# Altium project stm8l_resp.PrjPCB
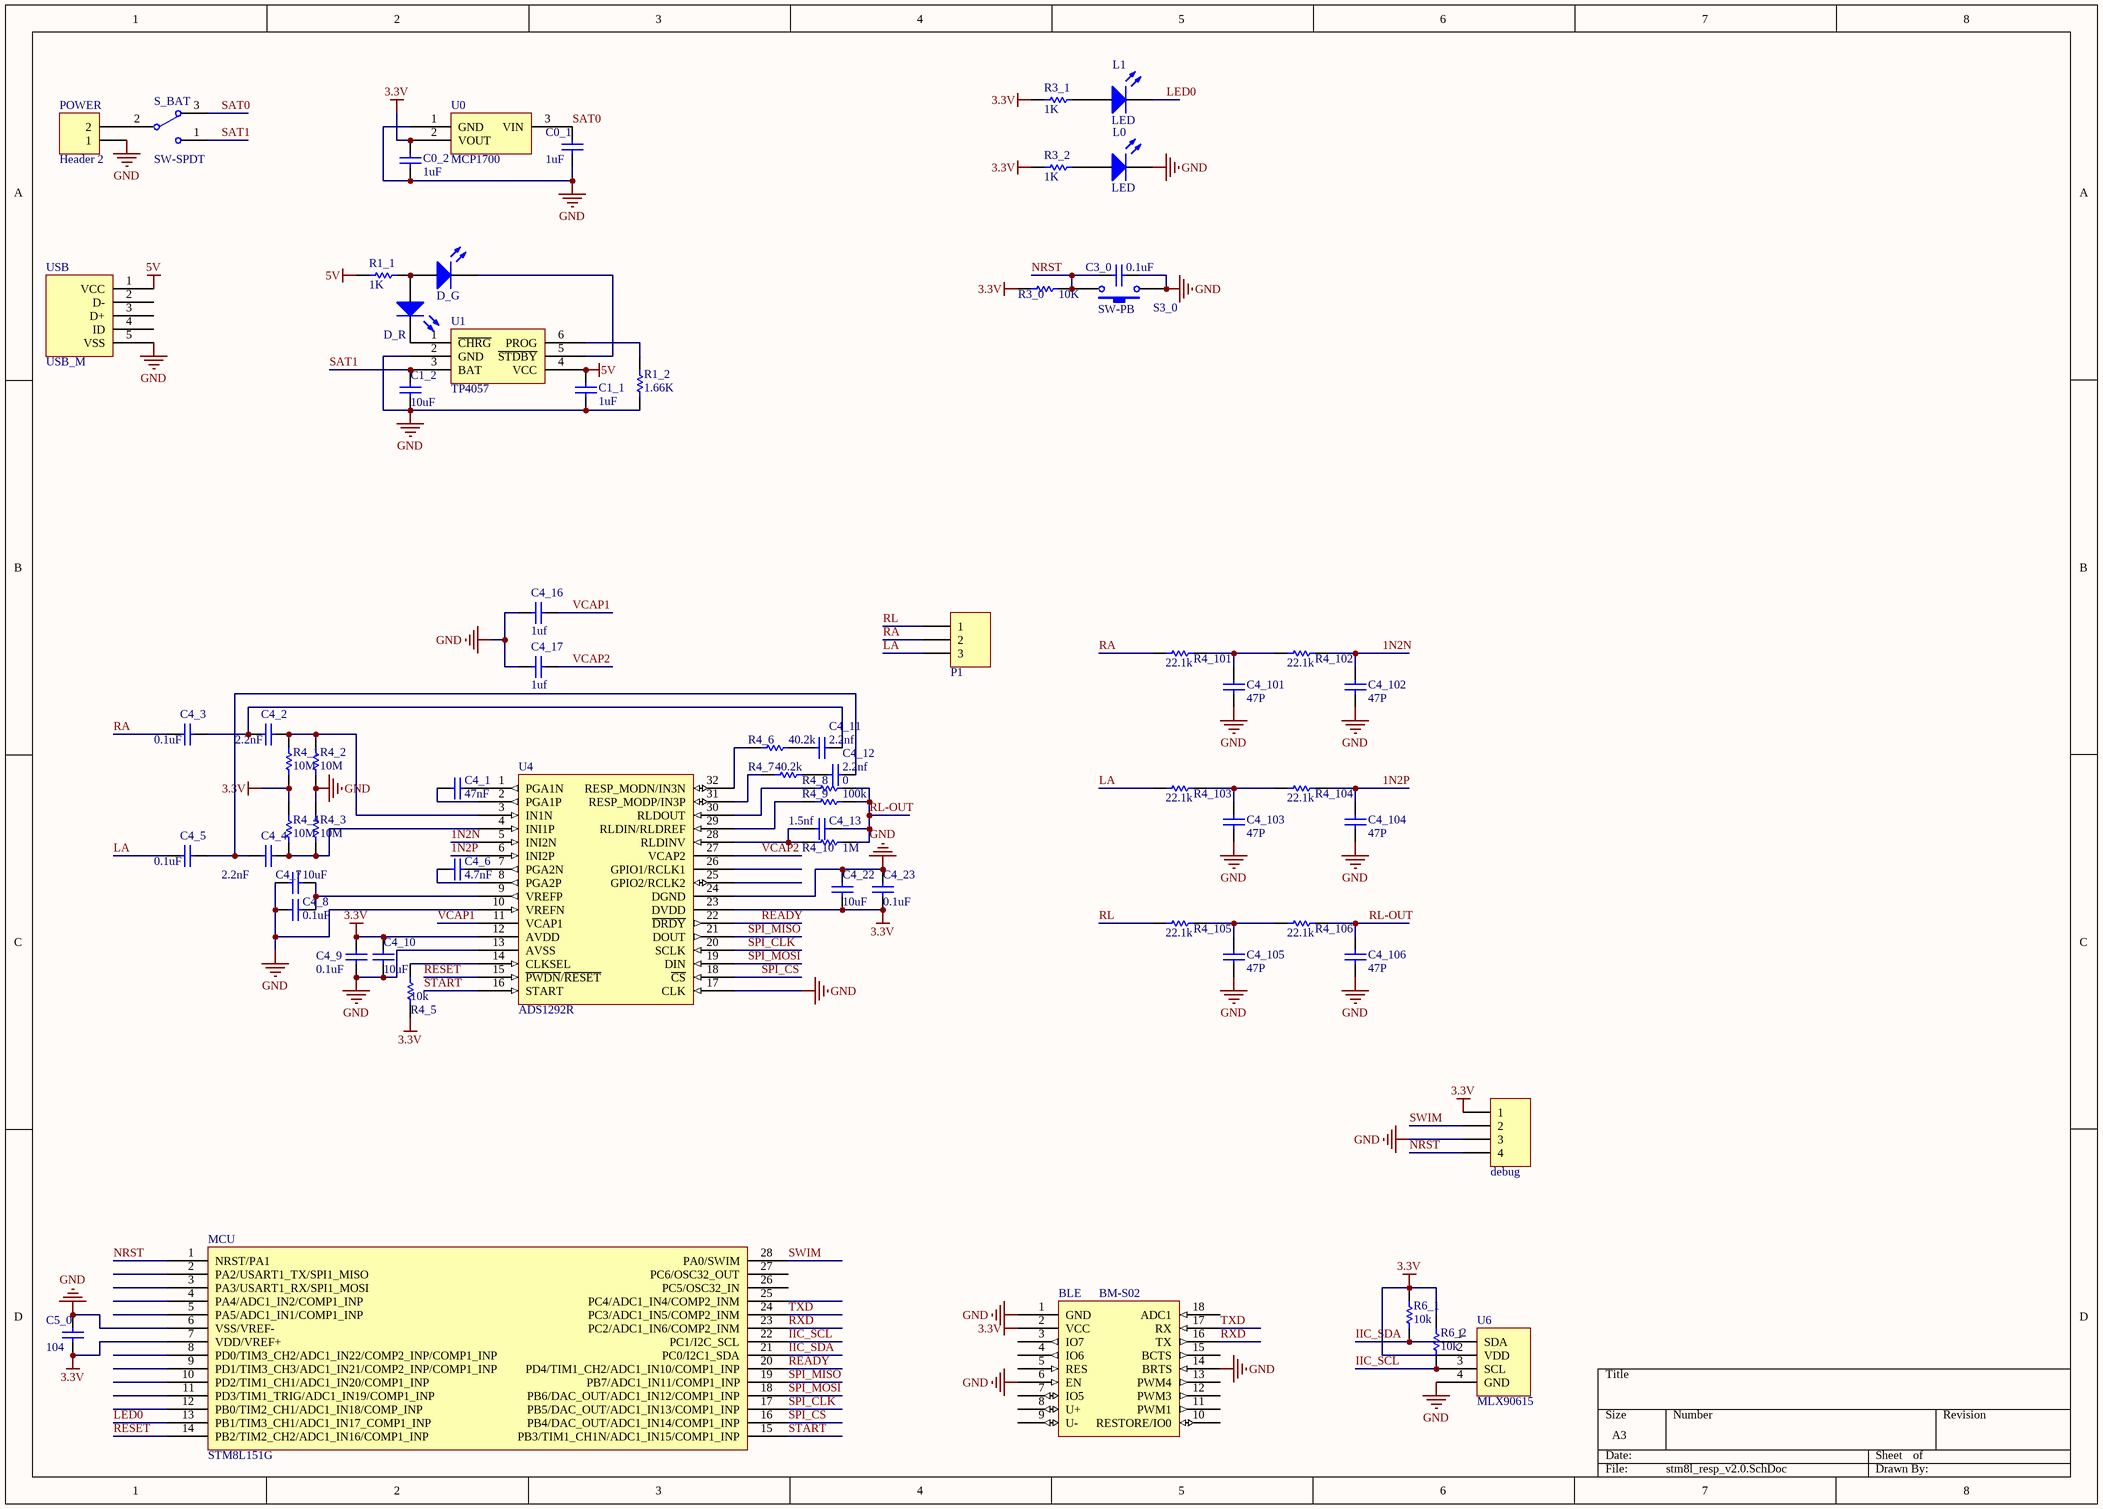
[diagram p0: stm8l_resp_v2.0.SchDoc]
1 sheet, 68 parts. Net scope: global (net labels, ports and power ports of the same name join across sheets).
Board file: stm8l_resp_v2.0.PcbDoc

## Sheet stm8l_resp_v2.0.SchDoc
size A3

### Parts
BLE  BM-S02  [BM-S02]
C0_1  value 1uF  [C-RAD-0603]  (hidden comment: Cap)
C0_2  value 1uF  [C-RAD-0603]  (hidden comment: Cap)
C1_1  value 1uF  [C-RAD-0603]  (hidden comment: Cap)
C1_2  value 10uF  [C-RAD-0603]  (hidden comment: Cap)
C3_0  value 0.1uF  [C-RAD-0603]  (hidden comment: Cap)
C4_1  value 47nF  [C-RAD-0603]  (hidden comment: Cap)
C4_2  value 2.2nF  [C-RAD-0603]  (hidden comment: Cap)
C4_3  value 0.1uF  [C-RAD-0603]  (hidden comment: Cap)
C4_4  value 2.2nF  [C-RAD-0603]  (hidden comment: Cap)
C4_5  value 0.1uF  [C-RAD-0603]  (hidden comment: Cap)
C4_6  value 4.7nF  [C-RAD-0603]  (hidden comment: Cap)
C4_7  value 10uF  [C-RAD-0603]  (hidden comment: Cap)
C4_8  value 0.1uF  [C-RAD-0603]  (hidden comment: Cap)
C4_9  value 0.1uF  [C-RAD-0603]  (hidden comment: Cap)
C4_10  value 10uF  [C-RAD-0603]  (hidden comment: Cap)
C4_11  value 2.2nf  [C-RAD-0603]  (hidden comment: Cap)
C4_12  value 2.2nf  [C-RAD-0603]  (hidden comment: Cap)
C4_13  value 1.5nf  [C-RAD-0603]  (hidden comment: Cap)
C4_16  value 1uf  [C-RAD-0603]  (hidden comment: Cap)
C4_17  value 1uf  [C-RAD-0603]  (hidden comment: Cap)
C4_22  value 10uF  [C-RAD-0603]  (hidden comment: Cap)
C4_23  value 0.1uF  [C-RAD-0603]  (hidden comment: Cap)
C4_101  value 47P  [C-RAD-0603]  (hidden comment: Cap)
C4_102  value 47P  [C-RAD-0603]  (hidden comment: Cap)
C4_103  value 47P  [C-RAD-0603]  (hidden comment: Cap)
C4_104  value 47P  [C-RAD-0603]  (hidden comment: Cap)
C4_105  value 47P  [C-RAD-0603]  (hidden comment: Cap)
C4_106  value 47P  [C-RAD-0603]  (hidden comment: Cap)
C5_0  value 104  [C-RAD-0603]  (hidden comment: Cap)
D_G  LED0  [0603-LED]  (value not drawn)
D_R  LED0  [0603-LED]  (value not drawn)
debug  Header 4  [HDR4X1_A]  (value not drawn)
L0  LED  [0603-LED]
L1  LED  [0603-LED]
MCU  STM8L151G  [STM8L-QFN28]
P1  Header 3  [HDR3X1_A]  (value not drawn)
POWER  Header 2  [HDR1X2]
R1_1  value 1K  [0603-1]  (hidden comment: Res1)
R1_2  value 1.66K  [0603-1]  (hidden comment: Res1)
R3_0  value 10K  [0603-1]  (hidden comment: Res1)
R3_1  value 1K  [0603-1]  (hidden comment: Res1)
R3_2  value 1K  [0603-1]  (hidden comment: Res1)
R4_1  value 10M  [0603-1]  (hidden comment: Res1)
R4_2  value 10M  [0603-1]  (hidden comment: Res1)
R4_3  value 10M  [0603-1]  (hidden comment: Res1)
R4_4  value 10M  [0603-1]  (hidden comment: Res1)
R4_5  value 10k  [0603-1]  (hidden comment: Res1)
R4_6  value 40.2k  [0603-1]  (hidden comment: Res1)
R4_7  value 40.2k  [0603-1]  (hidden comment: Res1)
R4_8  value 0  [0603-1]  (hidden comment: Res1)
R4_9  value 100k  [0603-1]  (hidden comment: Res1)
R4_10  value 1M  [0603-1]  (hidden comment: Res1)
R4_101  value 22.1k  [0603-1]  (hidden comment: Res1)
R4_102  value 22.1k  [0603-1]  (hidden comment: Res1)
R4_103  value 22.1k  [0603-1]  (hidden comment: Res1)
R4_104  value 22.1k  [0603-1]  (hidden comment: Res1)
R4_105  value 22.1k  [0603-1]  (hidden comment: Res1)
R4_106  value 22.1k  [0603-1]  (hidden comment: Res1)
R6_1  value 10k  [0603-1]  (hidden comment: Res1)
R6_2  value 10k  [0603-1]  (hidden comment: Res1)
S3_0  SW-PB  [SW_PB2_2*4]
S_BAT  SW-SPDT  [SWITCH_1P2T]
U0  MCP1700  [SOT-23]
U1  TP4057  [TP4057]
U4  ADS1292R  [ADS1292R-QFN-32]
U6  MLX90615  [MLX90615-2]
USB  USB_M  [USB_MICRO]

### Nets
3.3V: BLE.2(VCC) C0_2.2 C4_9.1 C4_10.1 C4_22.2 C4_23.2 C5_0.1 debug.1 MCU.7(VDD/VREF+) R3_0.1 R3_1.1 R3_2.1 R4_1.1 R4_4.2 R4_5.1 R6_1.2 R6_2.2 U0.2(VOUT) U4.12(AVDD) U4.23(DVDD) U6.2(VDD)
5V: C1_1.2 R1_1.2 U1.4(VCC) USB.1(VCC)
GND: BLE.1(GND) BLE.6(EN) BLE.14(BRTS) C0_1.1 C0_2.1 C1_1.1 C1_2.2 C3_0.1 C4_7.1 C4_8.2 C4_9.2 C4_10.2 C4_16.2 C4_17.2 C4_22.1 C4_23.1 C4_101.2 C4_102.2 C4_103.2 C4_104.2 C4_105.2 C4_106.2 C5_0.2 debug.3 L0.2(K) MCU.6(VSS/VREF-) POWER.1 R1_2.2 R4_2.1 R4_3.2 S3_0.1 U0.1(GND) U1.2(GND) U4.10(VREFN) U4.13(AVSS) U4.17(CLK) U4.24(DGND) U6.4(GND) USB.5(VSS)
1N2N: C4_102.1 R4_102.2 U4.5(INI2N)
1N2P: C4_104.1 R4_104.2 U4.6(INI2P)
IIC_SCL: MCU.22(PC1/I2C_SCL) R6_2.1 U6.3(SCL)
IIC_SDA: MCU.21(PC0/I2C1_SDA) R6_1.1 U6.1(SDA)
LA: C4_5.1 P1.3 R4_103.1
LED0: L1.2(K) MCU.13(PB1/TIM3_CH1/ADC1_IN17_COMP1_INP)
NRST: C3_0.2 debug.4 MCU.1(NRST/PA1) R3_0.2 S3_0.2
RA: C4_3.1 P1.2 R4_101.1
READY: MCU.20(PD4/TIM1_CH2/ADC1_IN10/COMP1_INP) U4.22(~{DRDY})
RESET: MCU.14(PB2/TIM2_CH2/ADC1_IN16/COMP1_INP) U4.15(~{PWDN}/~{RESET})
RL: P1.1 R4_105.1
RL-OUT: C4_13.1 C4_106.1 R4_8.1 R4_9.2 R4_10.2 R4_106.2
RXD: BLE.16(TX) MCU.23(PC2/ADC1_IN6/COMP2_INM)
SAT0: C0_1.2 S_BAT.3 U0.3(VIN)
SAT1: C1_2.1 S_BAT.1 U1.3(BAT)
SPI_CLK: MCU.17(PB5/DAC_OUT/ADC1_IN13/COMP1_INP) U4.20(SCLK)
SPI_CS: MCU.16(PB4/DAC_OUT/ADC1_IN14/COMP1_INP) U4.18(~{CS})
SPI_MISO: MCU.19(PB7/ADC1_IN11/COMP1_INP) U4.21(DOUT)
SPI_MOSI: MCU.18(PB6/DAC_OUT/ADC1_IN12/COMP1_INP) U4.19(DIN)
START: MCU.15(PB3/TIM1_CH1N/ADC1_IN15/COMP1_INP) U4.16(START)
SWIM: debug.2 MCU.28(PA0/SWIM)
TXD: BLE.17(RX) MCU.24(PC3/ADC1_IN5/COMP2_INM)
VCAP1: C4_16.1 U4.11(VCAP1)
VCAP2: C4_17.1 U4.27(VCAP2)
NetC4_1_1: C4_1.1 U4.2(PGA1P)
NetC4_1_2: C4_1.2 U4.1(PGA1N)
NetC4_2_1: C4_2.1 C4_3.2 C4_11.1
NetC4_2_2: C4_2.2 R4_1.2 R4_2.2 U4.3(IN1N)
NetC4_4_1: C4_4.1 C4_5.2 C4_12.1
NetC4_4_2: C4_4.2 R4_3.1 R4_4.1 U4.4(INI1P)
NetC4_6_1: C4_6.1 U4.7(PGA2N)
NetC4_6_2: C4_6.2 U4.8(PGA2P)
NetC4_7_2: C4_7.2 C4_8.1 U4.9(VREFP)
NetC4_11_2: C4_11.2 R4_6.2
NetC4_12_2: C4_12.2 R4_7.1
NetC4_13_2: C4_13.2 R4_10.1 U4.28(RLDINV)
NetC4_101_1: C4_101.1 R4_101.2 R4_102.1
NetC4_103_1: C4_103.1 R4_103.2 R4_104.1
NetC4_105_1: C4_105.1 R4_105.2 R4_106.1
NetD_G_1: D_G.1(A) D_R.1(A) R1_1.1
NetD_G_2: D_G.2(K) U1.5(~{STDBY})
NetD_R_2: D_R.2(K) U1.1(~{CHRG})
NetL0_1: L0.1(A) R3_2.2
NetL1_1: L1.1(A) R3_1.2
NetPOWER_2: POWER.2 S_BAT.2
NetR1_2_1: R1_2.1 U1.6(PROG)
NetR4_5_2: R4_5.2 U4.14(CLKSEL)
NetR4_6_1: R4_6.1 U4.32(RESP_MODN/IN3N)
NetR4_7_2: R4_7.2 U4.31(RESP_MODP/IN3P)
NetR4_8_2: R4_8.2 U4.30(RLDOUT)
NetR4_9_1: R4_9.1 U4.29(RLDIN/RLDREF)

Not connected (* = marked no-connect by the designer): BLE 3(IO7) 4(IO6) 5(RES) 7(IO5) 8(U+) 9(U-) 10(RESTORE/IO0) 11(PWM1) 12(PWM3) 13(PWM4) 15(BCTS) 18(ADC1); MCU 2(PA2/USART1_TX/SPI1_MISO) 3(PA3/USART1_RX/SPI1_MOSI) 4(PA4/ADC1_IN2/COMP1_INP) 5(PA5/ADC1_IN1/COMP1_INP) 8(PD0/TIM3_CH2/ADC1_IN22/COMP2_INP/COMP1_INP) 9(PD1/TIM3_CH3/ADC1_IN21/COMP2_INP/COMP1_INP) 10(PD2/TIM1_CH1/ADC1_IN20/COMP1_INP) 11(PD3/TIM1_TRIG/ADC1_IN19/COMP1_INP) 12(PB0/TIM2_CH1/ADC1_IN18/COMP_INP) 25(PC4/ADC1_IN4/COMP2_INM) 26(PC5/OSC32_IN) 27(PC6/OSC32_OUT); U4 25(GPIO2/RCLK2) 26(GPIO1/RCLK1); USB 2(D-) 3(D+) 4(ID)

### Library data of the parts
BLE = BM-S02: 蓝牙4.0模块
C0_1 C0_2 C1_1 C1_2 C3_0 C4_1-C4_13 C4_16 C4_17 C4_22 C4_23 C4_101-C4_106 C5_0 = Cap: 无极性电容; Published: 8-Jun-2000; LatestRevisionDate: 17-Jul-2002; LatestRevisionNote: Re-released for DXP Platform.; PackageReference: RAD-0.3; Publisher: Altium Limited
D_G D_R = LED0: 发光二极管; Published: 8-Jun-2000; LatestRevisionDate: 08-Jul-2005; LatestRevisionNote: Mech Layer 1 removed.; PackageReference: LED-0; Publisher: Altium Limited
debug = Header 4: 接插件; LatestRevisionDate: 17-Jul-2002; LatestRevisionNote: Re-released for DXP Platform.; Publisher: Altium Limited
MCU = STM8L151G: STM8L单片机28引脚
P1 = Header 3: 接插件; LatestRevisionDate: 17-Jul-2002; LatestRevisionNote: Re-released for DXP Platform.; Publisher: Altium Limited
POWER = Header 2: Header, 2-Pin; LatestRevisionDate: 17-Jul-2002; LatestRevisionNote: Re-released for DXP Platform.; Publisher: Altium Limited
R1_1 R1_2 R3_0-R3_2 R4_1-R4_10 R4_101-R4_106 R6_1 R6_2 = Res1: 贴片电阻; Published: 8-Jun-2000; LatestRevisionDate: 17-Jul-2002; LatestRevisionNote: Re-released for DXP Platform.; PackageReference: AXIAL-0.4; Publisher: Altium Limited
S3_0 = SW-PB: 微动开关; Published: 24-Mar-1999; LatestRevisionDate: 17-Jul-2002; LatestRevisionNote: Re-released for DXP Platform.; PackageReference: SPST-2; Publisher: Altium Limited
S_BAT = SW-SPDT: 开关; Published: 24-Mar-1999; LatestRevisionDate: 17-Dec-2003; LatestRevisionNote: Schematic revised, PCB Footprint replaced.; DatasheetDocument: 05-Dec-2000; PackageReference: TL36WW15050; Publisher: Altium Limited; ComponentLink1Description: Manufacturer Link; ComponentLink1URL: http://www.apem.com
U0 = MCP1700: 微型稳压芯片
U1 = TP4057: 锂电池充电管理
U4 = ADS1292R: 集成呼吸阻抗 ECG 前端
U6 = MLX90615: 红外体温传感器
USB = USB_M: MicroUSB接口